# EAGLE design frontpanel (EAGLE 7.6.0)
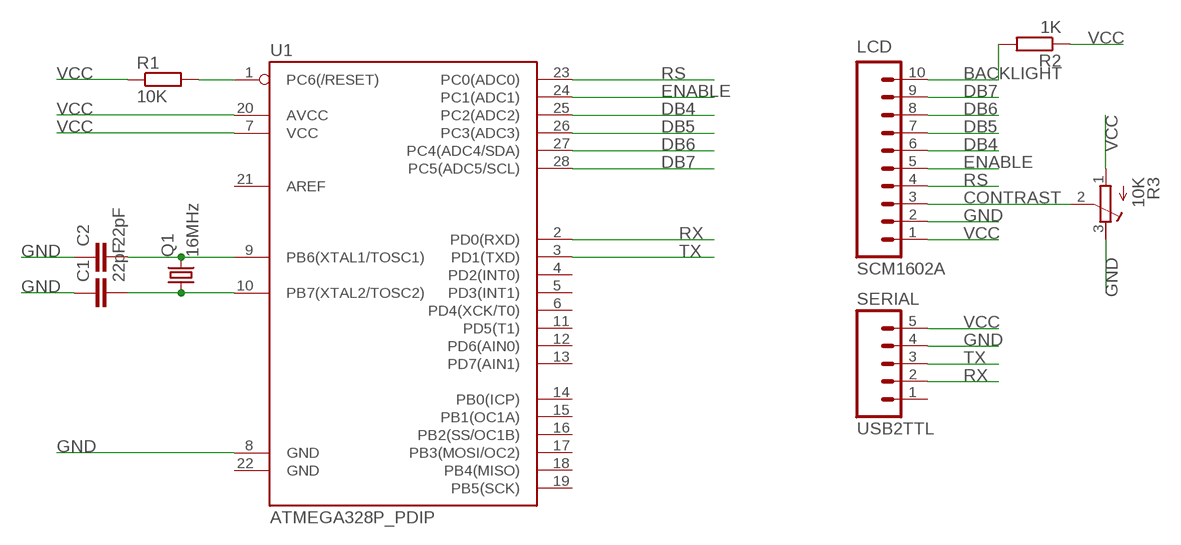
[diagram p0: schematic, sheet 1]

## Parts
C1  22pF  0.1UF-50V-20%(PTH)KIT-EZ  [CAP-PTH-SMALL-KIT]
C2  22pF  0.1UF-50V-20%(PTH)KIT-EZ  [CAP-PTH-SMALL-KIT]
LCD  SCM1602A  M10SILK_FEMALE_PTH  [1X10]
Q1  16MHz  CRYSTALHC49S  [HC49/S]
R1  10K  R-EU_0204/7  [0204/7]
R2  1K  R-EU_0204/7  [0204/7]
R3  10K  R-TRIMM64X  [RTRIM64X]
SERIAL  USB2TTL  M05PTH  [1X05]
U1  ATMEGA328P_PDIP  [DIL28-3]

## Nets
BACKLIGHT: LCD.10 R2.2
CONTRAST: LCD.3 R3.2(S)
DB4: LCD.6 U1.25(PC2(ADC2))
DB5: LCD.7 U1.26(PC3(ADC3))
DB6: LCD.8 U1.27(PC4(ADC4/SDA))
DB7: LCD.9 U1.28(PC5(ADC5/SCL))
ENABLE: LCD.5 U1.24(PC1(ADC1))
GND: C1.1 C2.1 LCD.2 R3.3(E) SERIAL.4 U1.8(GND)
N$1: R1.2 U1.1(PC6(/RESET))
N$2: C1.2 Q1.1 U1.10(PB7(XTAL2/TOSC2))
N$5: C2.2 Q1.2 U1.9(PB6(XTAL1/TOSC1))
RS: LCD.4 U1.23(PC0(ADC0))
RX: SERIAL.2 U1.2(PD0(RXD))
TX: SERIAL.3 U1.3(PD1(TXD))
VCC: LCD.1 R1.1 R2.1 R3.1(A) SERIAL.5 U1.7(VCC) U1.20(AVCC)
Unconnected: SERIAL.1 U1.4(PD2(INT0)) U1.5(PD3(INT1)) U1.6(PD4(XCK/T0)) U1.11(PD5(T1)) U1.12(PD6(AIN0)) U1.13(PD7(AIN1)) U1.14(PB0(ICP)) U1.15(PB1(OC1A)) U1.16(PB2(SS/OC1B)) U1.17(PB3(MOSI/OC2)) U1.18(PB4(MISO)) U1.19(PB5(SCK)) U1.21(AREF) U1.22(GND)

## Library data of the parts
C1 C2 = SparkFun-Capacitors:0.1UF-50V-20%(PTH): CAP-08370; PROD_ID: CAP-08370
LCD = SparkFun-Connectors:M10: Header 10 Standard 10-pin 0.1" header. Use with straight break away headers (SKU : PRT-00116), right angle break away headers (PRT-00553), swiss pins (PRT-00743), machine pins (PRT-00117), and female headers (PRT-00115).; PROD_ID: CONN-11563
Q1 = crystal:CRYSTAL: CRYSTAL; OC_FARNELL: 1667008; OC_NEWARK: unknown
R1 R2 = resistor:R-EU_: RESISTOR, European symbol
R3 = rcl:R-TRIMM: Trimm resistor
SERIAL = SparkFun-Connectors:M05: Header 5 Standard 5-pin 0.1" header. Use with straight break away headers (SKU : PRT-00116), right angle break away headers (PRT-00553), swiss pins (PRT-00743), machine pins (PRT-00117), and female headers (PRT-00115). Molex polarized connector foot print use with SKU : PRT-08230 with associated crimp pins and housings.
U1 = SparkFun-DigitalIC:ATMEGA328P_PDIP: uC used in the Arduino 32kb flash, 1k EEPROM, 2k SRAM This is the through-hole version of this chip.

## Board
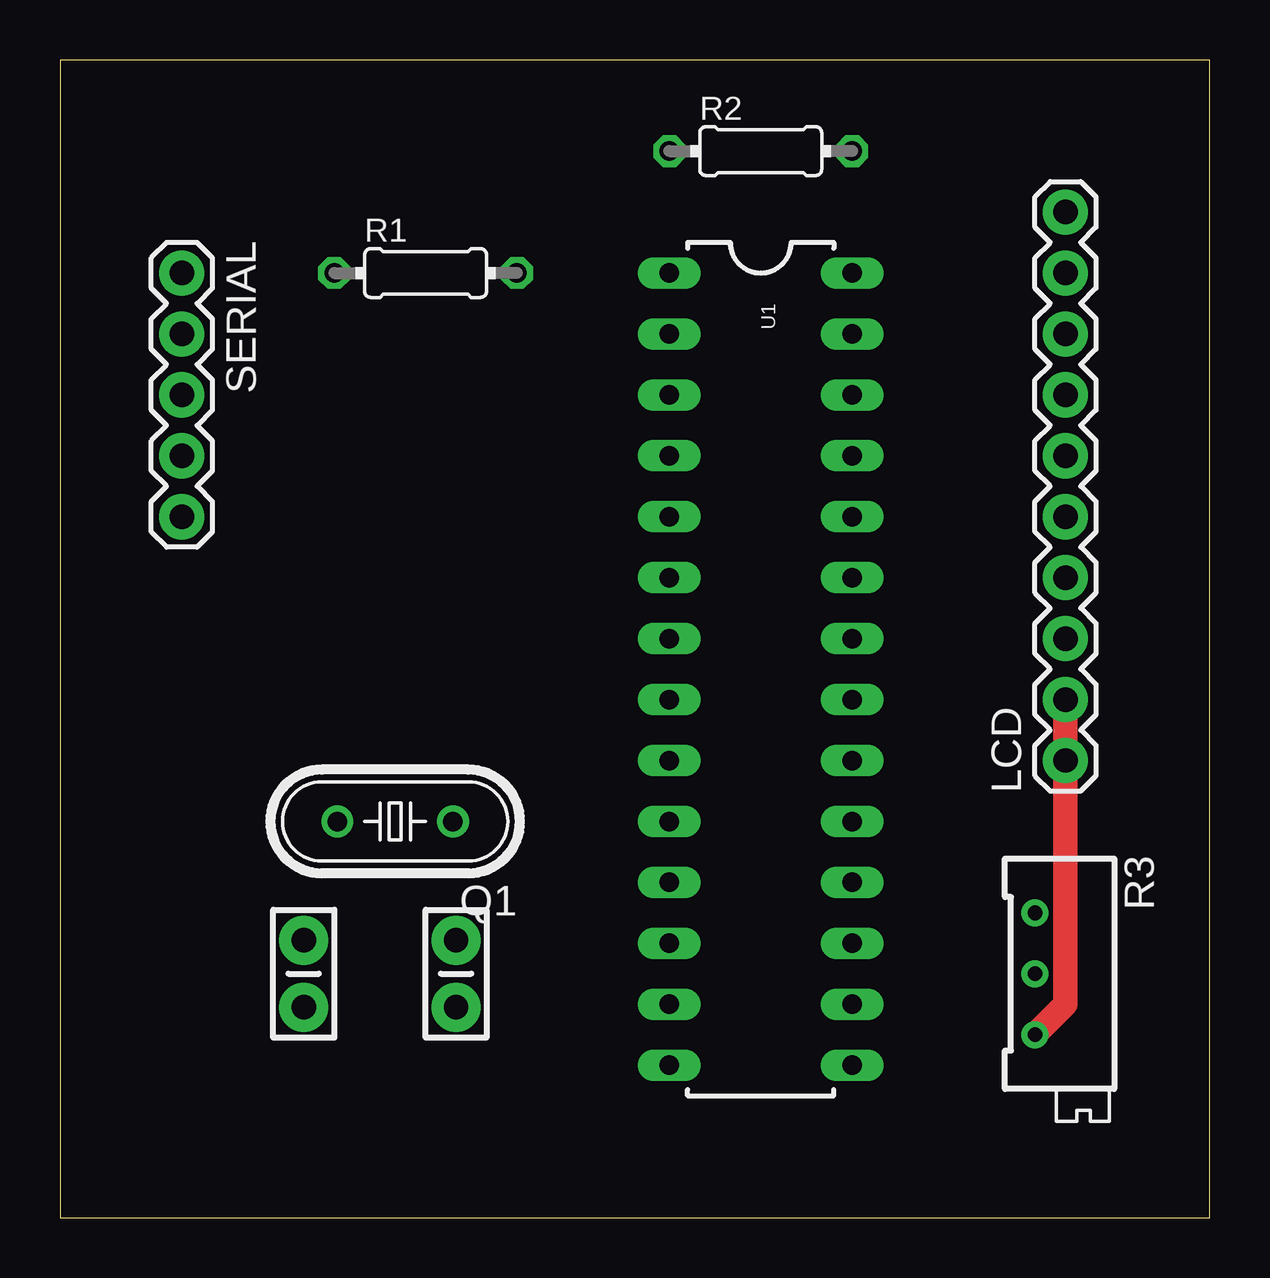
[diagram p1: board, top side]
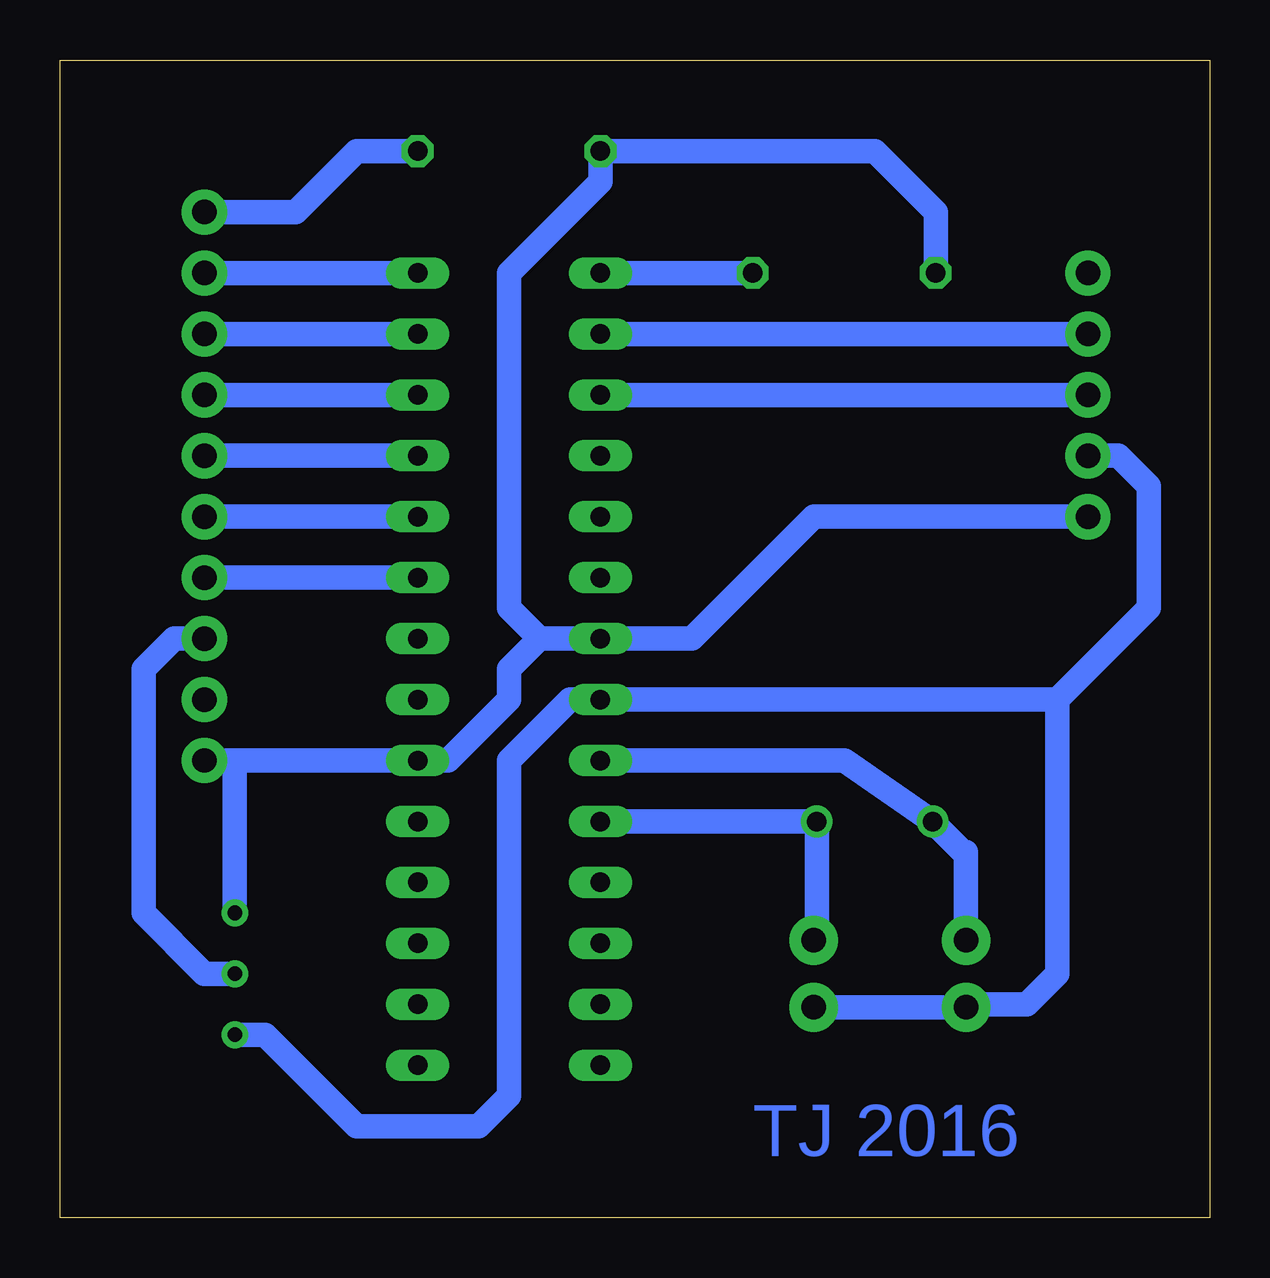
[diagram p2: board, bottom side, seen from below]

Size 47.93 x 48.25 mm. Coordinates in mm from the lower left corner, seen from the top.
Outline: 0,0 47.93,0 47.93,48.25 0,48.25 0,0
Copper layers (1*16): Top 0.035mm / dielectric 1.5mm / Bottom 0.035mm
Design rules "default": minimum track width 10mil, minimum drill 24mil, track to track 8mil, track to pad 8mil, pad to pad 8mil, via to via 8mil, smd to smd 8mil, copper to edge 40mil, drill to drill 8mil, minimum pad ring 10mil, minimum via ring 8mil, stop-mask expansion 4mil, vias tented up to drill 0mil, thermal gap 10mil

### Footprints (pad centres in the part's own frame; a part is rotated, then mirrored left to right if it is on the bottom)
CAP-PTH-SMALL-KIT = drill 1.016 pad 2.032: 1 -1.397,0; 2 1.397,0
1X10 = drill 1.016 pad 1.88: 1 0,0; 2 2.54,0; 3 5.08,0; 4 7.62,0; 5 10.16,0; 6 12.7,0; 7 15.24,0; 8 17.78,0; 9 20.32,0; 10 22.86,0
HC49/S = drill 0.813: 1 -2.413,0; 2 2.413,0
0204/7 = drill 0.813 octagon: 1 -3.81,0; 2 3.81,0
RTRIM64X = drill 0.61: 1 1.27,-2.54; 2 1.27,0; 3 1.27,2.54
1X05 = drill 1.016 pad 1.88: 1 0,0; 2 2.54,0; 3 5.08,0; 4 7.62,0; 5 10.16,0
DIL28-3 = drill 0.813 long: 1 -16.51,-3.81; 2 -13.97,-3.81; 3 -11.43,-3.81; 4 -8.89,-3.81; 5 -6.35,-3.81; 6 -3.81,-3.81; 7 -1.27,-3.81; 8 1.27,-3.81; 9 3.81,-3.81; 10 6.35,-3.81; 11 8.89,-3.81; 12 11.43,-3.81; 13 13.97,-3.81; 14 16.51,-3.81; 15 16.51,3.81; 16 13.97,3.81; 17 11.43,3.81; 18 8.89,3.81; 19 6.35,3.81; 20 3.81,3.81; 21 1.27,3.81; 22 -1.27,3.81; 23 -3.81,3.81; 24 -6.35,3.81; 25 -8.89,3.81; 26 -11.43,3.81; 27 -13.97,3.81; 28 -16.51,3.81

### Placement (x,y rotation side)
C1  16.51,10.16 90 top
C2  10.16,10.16 90 top
LCD  41.91,19.05 90 top
Q1  13.97,16.51 180 top
R1  15.24,39.37 0 top
R2  29.21,44.45 0 top
R3  41.91,10.16 180 top
SERIAL  5.08,39.37 270 top
U1  29.21,22.86 270 top

### Tracks (layer width: path | path; a pad name or v marks a point on that pad's centre or on a via)
BACKLIGHT
  Bottom 1.016: R2.2 35.56,44.45 38.1,41.91 LCD.10
CONTRAST
  Bottom 1.016: R3.2 41.91,10.16 44.45,12.7 44.45,22.86 43.18,24.13 LCD.3
DB4
  Bottom 1.016: LCD.6 U1.25
DB5
  Bottom 1.016: U1.26 LCD.7
DB6
  Bottom 1.016: LCD.8 U1.27
DB7
  Bottom 1.016: U1.28 LCD.9
ENABLE
  Bottom 1.016: U1.24 LCD.5
GND
  Top 1.016: LCD.2 41.91,8.89 R3.3
  Bottom 1.016: SERIAL.4 3.81,31.75 2.54,30.48 2.54,25.4 6.35,21.59 | 6.35,21.59 6.35,10.16 7.62,8.89 10.03,8.89 C2.1 C1.1 | 6.35,21.59 U1.8 26.67,21.59 29.21,19.05 29.21,5.08 30.48,3.81 35.56,3.81 39.37,7.62 R3.3
N$1
  Bottom 1.016: U1.1 R1.2
N$2
  Bottom 1.016: C1.2 16.38,11.68 Q1.1 U1.10
N$5
  Bottom 1.016: C2.2 10.16,15.24 10.29,15.24 Q1.2 15.24,19.05 U1.9
RS
  Bottom 1.016: U1.23 LCD.4
RX
  Bottom 1.016: U1.2 SERIAL.2
TX
  Bottom 1.016: U1.3 SERIAL.3
VCC
  Bottom 1.016: SERIAL.5 16.51,29.21 21.59,24.13 U1.7 27.94,24.13 | R1.1 11.43,41.91 13.97,44.45 R2.1 25.4,43.18 29.21,39.37 29.21,25.4 27.94,24.13 | 27.94,24.13 29.21,22.86 29.21,21.59 31.75,19.05 U1.20 40.64,19.05 | 40.64,19.05 LCD.1 | R3.1 40.64,19.05

### Text on the board
Bottom: TJ 2016